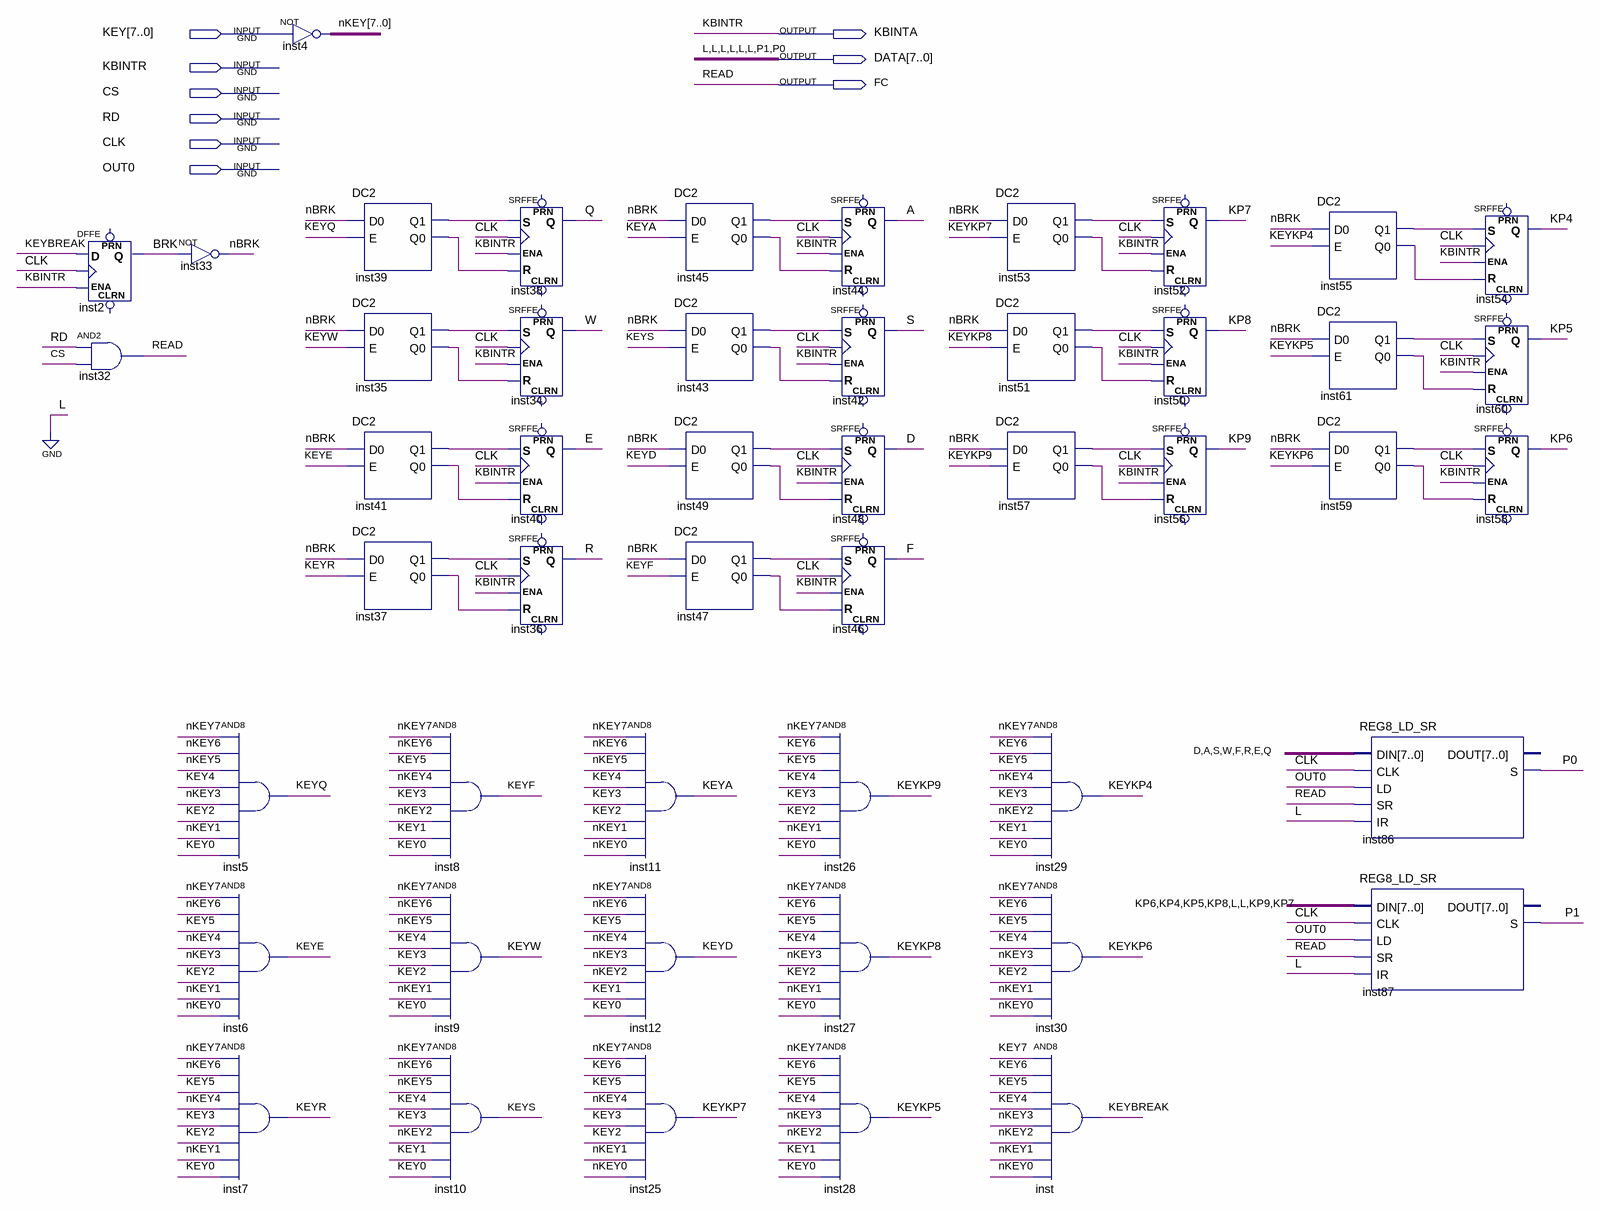
[diagram p0: schematic sheet]
// Quartus schematic kb_gamepad_bridge.bdf as structural Verilog: 49 symbols, 9 pins
module kb_gamepad_bridge (
  input  [7:0] KEY,
  input  KBINTR,
  input  CS,
  input  RD,
  input  CLK,
  input  OUT0,
  output KBINTA,
  output [7:0] DATA,
  output FC
);

  wire A, BRK, D, E, F, inst35_q0, inst35_q1, inst37_q0, inst37_q1, inst39_q0, inst39_q1, inst41_q0,
       inst41_q1, inst43_q0, inst43_q1, inst45_q0, inst45_q1, inst47_q0, inst47_q1, inst49_q0, inst49_q1,
       inst51_q0, inst51_q1, inst53_q0, inst53_q1, inst55_q0, inst55_q1, inst57_q0, inst57_q1, inst59_q0,
       inst59_q1, inst61_q0, inst61_q1, KEYA, KEYBREAK, KEYD, KEYE, KEYF, KEYKP4, KEYKP5, KEYKP6, KEYKP7,
       KEYKP8, KEYKP9, KEYQ, KEYR, KEYS, KEYW, KP4, KP5, KP6, KP7, KP8, KP9, nBRK, Q, R, S, W;
  wire [7:0] nKEY;

  DFFE inst2 (.D(KEYBREAK), .CLK(CLK), .ENA(KBINTR), .Q(BRK));  // open: PRN, CLRN
  and inst32 (FC, RD, CS);
  not inst33 (nBRK, BRK);
  and inst5 (KEYQ, nKEY[7], nKEY[6], nKEY[5], KEY[4], nKEY[3], KEY[2], nKEY[1], KEY[0]);
  and inst6 (KEYE, nKEY[7], nKEY[6], KEY[5], nKEY[4], nKEY[3], KEY[2], nKEY[1], nKEY[0]);
  and inst7 (KEYR, nKEY[7], nKEY[6], KEY[5], nKEY[4], KEY[3], KEY[2], nKEY[1], KEY[0]);
  assign nKEY = ~KEY;  // NOT inst4, 8 bits wide
  DC2 inst39 (.D0(nBRK), .E(KEYQ), .Q1(inst39_q1), .Q0(inst39_q0));
  DC2 inst35 (.D0(nBRK), .E(KEYW), .Q1(inst35_q1), .Q0(inst35_q0));
  DC2 inst41 (.D0(nBRK), .E(KEYE), .Q1(inst41_q1), .Q0(inst41_q0));
  DC2 inst37 (.D0(nBRK), .E(KEYR), .Q1(inst37_q1), .Q0(inst37_q0));
  and inst8 (KEYF, nKEY[7], nKEY[6], KEY[5], nKEY[4], KEY[3], nKEY[2], KEY[1], KEY[0]);
  and inst9 (KEYW, nKEY[7], nKEY[6], nKEY[5], KEY[4], KEY[3], KEY[2], nKEY[1], KEY[0]);
  and inst10 (KEYS, nKEY[7], nKEY[6], nKEY[5], KEY[4], KEY[3], nKEY[2], KEY[1], KEY[0]);
  SRFFE inst38 (.S(inst39_q1), .CLK(CLK), .R(inst39_q0), .ENA(KBINTR), .Q(Q));  // open: PRN, CLRN
  SRFFE inst34 (.S(inst35_q1), .CLK(CLK), .R(inst35_q0), .ENA(KBINTR), .Q(W));  // open: PRN, CLRN
  SRFFE inst40 (.S(inst41_q1), .CLK(CLK), .R(inst41_q0), .ENA(KBINTR), .Q(E));  // open: PRN, CLRN
  SRFFE inst36 (.S(inst37_q1), .CLK(CLK), .R(inst37_q0), .ENA(KBINTR), .Q(R));  // open: PRN, CLRN
  DC2 inst45 (.D0(nBRK), .E(KEYA), .Q1(inst45_q1), .Q0(inst45_q0));
  DC2 inst43 (.D0(nBRK), .E(KEYS), .Q1(inst43_q1), .Q0(inst43_q0));
  DC2 inst49 (.D0(nBRK), .E(KEYD), .Q1(inst49_q1), .Q0(inst49_q0));
  DC2 inst47 (.D0(nBRK), .E(KEYF), .Q1(inst47_q1), .Q0(inst47_q0));
  and inst11 (KEYA, nKEY[7], nKEY[6], nKEY[5], KEY[4], KEY[3], KEY[2], nKEY[1], nKEY[0]);
  and inst12 (KEYD, nKEY[7], nKEY[6], KEY[5], nKEY[4], nKEY[3], nKEY[2], KEY[1], KEY[0]);
  and inst25 (KEYKP7, nKEY[7], KEY[6], KEY[5], nKEY[4], KEY[3], KEY[2], nKEY[1], nKEY[0]);
  SRFFE inst44 (.S(inst45_q1), .CLK(CLK), .R(inst45_q0), .ENA(KBINTR), .Q(A));  // open: PRN, CLRN
  SRFFE inst42 (.S(inst43_q1), .CLK(CLK), .R(inst43_q0), .ENA(KBINTR), .Q(S));  // open: PRN, CLRN
  SRFFE inst48 (.S(inst49_q1), .CLK(CLK), .R(inst49_q0), .ENA(KBINTR), .Q(D));  // open: PRN, CLRN
  SRFFE inst46 (.S(inst47_q1), .CLK(CLK), .R(inst47_q0), .ENA(KBINTR), .Q(F));  // open: PRN, CLRN
  and inst26 (KEYKP9, nKEY[7], KEY[6], KEY[5], KEY[4], KEY[3], KEY[2], nKEY[1], KEY[0]);
  and inst27 (KEYKP8, nKEY[7], KEY[6], KEY[5], KEY[4], nKEY[3], KEY[2], nKEY[1], KEY[0]);
  and inst28 (KEYKP5, nKEY[7], KEY[6], KEY[5], KEY[4], nKEY[3], nKEY[2], KEY[1], KEY[0]);
  DC2 inst53 (.D0(nBRK), .E(KEYKP7), .Q1(inst53_q1), .Q0(inst53_q0));
  DC2 inst51 (.D0(nBRK), .E(KEYKP8), .Q1(inst51_q1), .Q0(inst51_q0));
  DC2 inst57 (.D0(nBRK), .E(KEYKP9), .Q1(inst57_q1), .Q0(inst57_q0));
  and inst29 (KEYKP4, nKEY[7], KEY[6], KEY[5], nKEY[4], KEY[3], nKEY[2], KEY[1], KEY[0]);
  and inst30 (KEYKP6, nKEY[7], KEY[6], KEY[5], KEY[4], nKEY[3], KEY[2], nKEY[1], nKEY[0]);
  and inst (KEYBREAK, KEY[7], KEY[6], KEY[5], KEY[4], nKEY[3], nKEY[2], nKEY[1], nKEY[0]);
  SRFFE inst52 (.S(inst53_q1), .CLK(CLK), .R(inst53_q0), .ENA(KBINTR), .Q(KP7));  // open: PRN, CLRN
  SRFFE inst50 (.S(inst51_q1), .CLK(CLK), .R(inst51_q0), .ENA(KBINTR), .Q(KP8));  // open: PRN, CLRN
  SRFFE inst56 (.S(inst57_q1), .CLK(CLK), .R(inst57_q0), .ENA(KBINTR), .Q(KP9));  // open: PRN, CLRN
  DC2 inst55 (.D0(nBRK), .E(KEYKP4), .Q1(inst55_q1), .Q0(inst55_q0));
  DC2 inst61 (.D0(nBRK), .E(KEYKP5), .Q1(inst61_q1), .Q0(inst61_q0));
  DC2 inst59 (.D0(nBRK), .E(KEYKP6), .Q1(inst59_q1), .Q0(inst59_q0));
  REG8_LD_SR inst86 (
    .DIN({D, A, S, W, F, R, E, Q}), .CLK(CLK), .LD(OUT0), .SR(FC), .IR(1'b0), .S(DATA[0]));  // open: DOUT
  REG8_LD_SR inst87 (
    .DIN({KP6, KP4, KP5, KP8, 2'b00, KP9, KP7}), .CLK(CLK), .LD(OUT0), .SR(FC), .IR(1'b0), .S(DATA[1]));  // open: DOUT
  SRFFE inst54 (.S(inst55_q1), .CLK(CLK), .R(inst55_q0), .ENA(KBINTR), .Q(KP4));  // open: PRN, CLRN
  SRFFE inst60 (.S(inst61_q1), .CLK(CLK), .R(inst61_q0), .ENA(KBINTR), .Q(KP5));  // open: PRN, CLRN
  SRFFE inst58 (.S(inst59_q1), .CLK(CLK), .R(inst59_q0), .ENA(KBINTR), .Q(KP6));  // open: PRN, CLRN

  assign DATA[7:2] = {6{1'b0}};
  assign KBINTA = KBINTR;

  // Other names for the same wires on the sheet: P0 = DATA[0]; P1 = DATA[1]; READ = FC
endmodule
